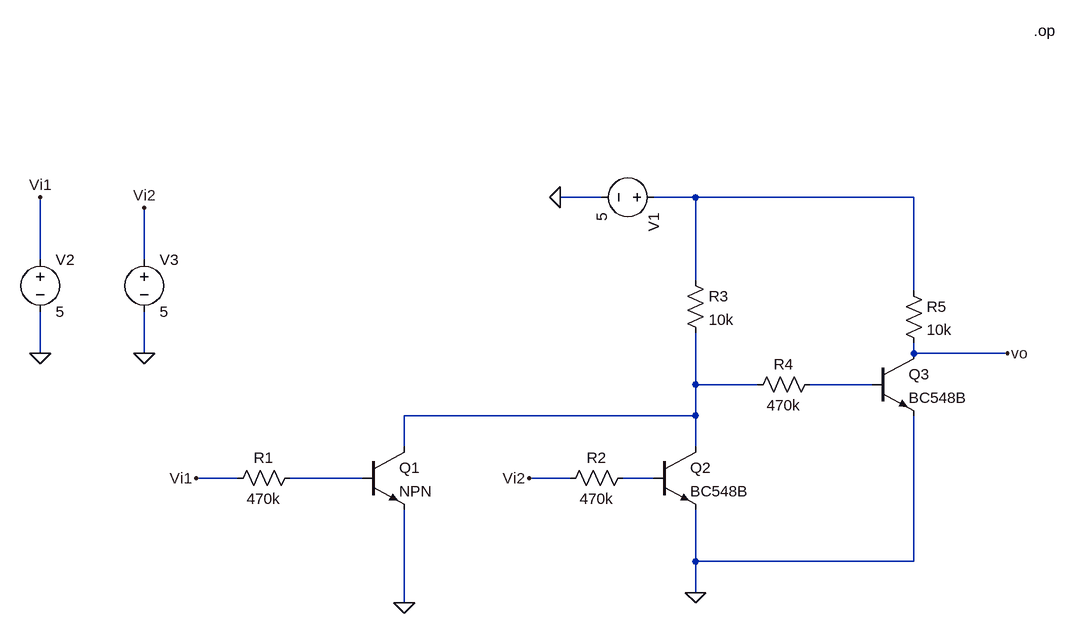
[diagram p0: schematic A04 - Simulacao.asc]
A04 - Simulacao.asc, the LTspice schematic file:
Version 4
SHEET 1 1584 680
WIRE 880 -176 816 -176
WIRE 1024 -176 960 -176
WIRE 1360 -176 1024 -176
WIRE 16 -80 16 -176
WIRE 176 -80 176 -160
WIRE 1024 -48 1024 -176
WIRE 1360 -32 1360 -176
WIRE 16 64 16 0
WIRE 176 64 176 0
WIRE 1360 64 1360 48
WIRE 1504 64 1360 64
WIRE 1024 112 1024 32
WIRE 1120 112 1024 112
WIRE 1296 112 1200 112
WIRE 1024 160 1024 112
WIRE 1024 160 576 160
WIRE 576 208 576 160
WIRE 1024 208 1024 160
WIRE 320 256 256 256
WIRE 512 256 400 256
WIRE 832 256 768 256
WIRE 960 256 912 256
WIRE 1024 384 1024 304
WIRE 1360 384 1360 160
WIRE 1360 384 1024 384
WIRE 1024 432 1024 384
WIRE 576 448 576 304
FLAG 576 448 0
FLAG 1024 432 0
FLAG 816 -176 0
FLAG 768 256 Vi2
FLAG 256 256 Vi1
FLAG 16 64 0
FLAG 176 64 0
FLAG 176 -160 Vi2
FLAG 16 -176 Vi1
FLAG 1504 64 vo
SYMBOL voltage 976 -176 R90
WINDOW 123 0 0 Left 0
WINDOW 39 0 0 Left 0
SYMATTR InstName V1
SYMATTR Value 5
SYMBOL npn 512 208 R0
SYMATTR InstName Q1
SYMBOL npn 960 208 R0
SYMATTR InstName Q2
SYMATTR Value BC548B
SYMBOL res 416 240 R90
WINDOW 0 0 56 VBottom 2
WINDOW 3 32 56 VTop 2
SYMATTR InstName R1
SYMATTR Value 470k
SYMBOL res 928 240 R90
WINDOW 0 0 56 VBottom 2
WINDOW 3 32 56 VTop 2
SYMATTR InstName R2
SYMATTR Value 470k
SYMBOL res 1008 -64 R0
SYMATTR InstName R3
SYMATTR Value 10k
SYMBOL voltage 16 -96 R0
WINDOW 123 0 0 Left 0
WINDOW 39 0 0 Left 0
SYMATTR InstName V2
SYMATTR Value 5
SYMBOL voltage 176 -96 R0
WINDOW 123 0 0 Left 0
WINDOW 39 0 0 Left 0
SYMATTR InstName V3
SYMATTR Value 5
SYMBOL res 1216 96 R90
WINDOW 0 0 56 VBottom 2
WINDOW 3 32 56 VTop 2
SYMATTR InstName R4
SYMATTR Value 470k
SYMBOL npn 1296 64 R0
SYMATTR InstName Q3
SYMATTR Value BC548B
SYMBOL res 1344 -48 R0
SYMATTR InstName R5
SYMATTR Value 10k
TEXT 1544 -432 Left 2 !.op

The netlist it stands for:
* A04 - Simulacao.asc
V1 N001 0 5
Q1 N002 N004 0 0 NPN
Q2 N002 N005 0 0 BC548B
R1 N004 Vi1 470k
R2 N005 Vi2 470k
R3 N001 N002 10k
V2 Vi1 0 5
V3 Vi2 0 5
R4 N003 N002 470k
Q3 vo N003 0 0 BC548B
R5 N001 vo 10k
.model NPN NPN
.model PNP PNP
.lib standard.bjt
.op
.backanno
.end